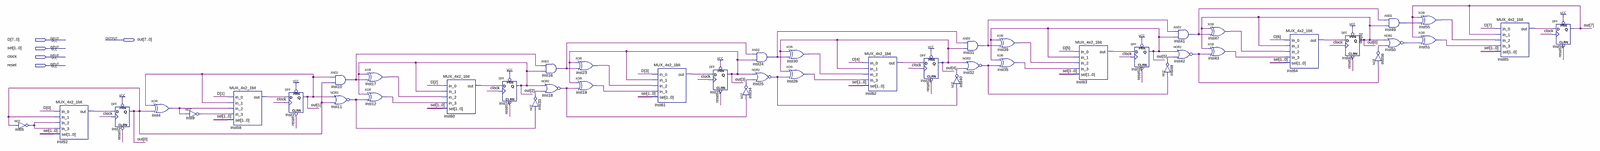
[diagram p0: schematic sheet, whole]
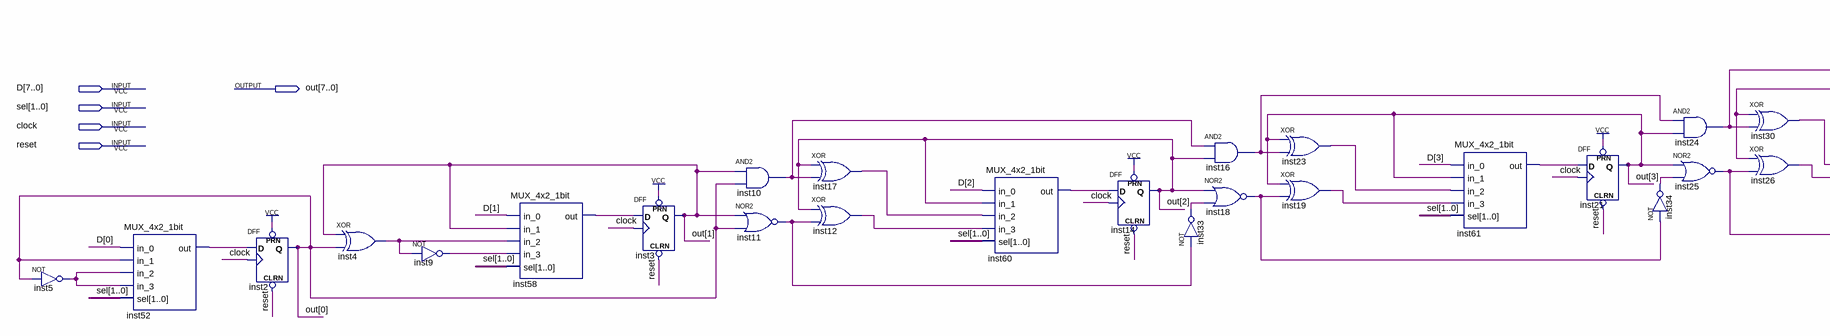
[diagram p1: schematic sheet, left part]
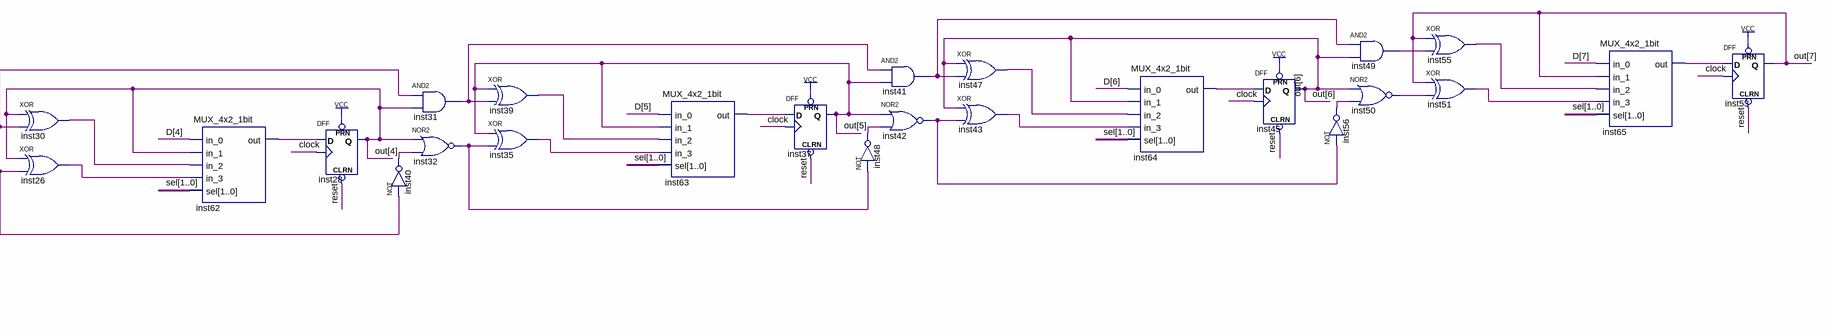
[diagram p2: schematic sheet, right part]
// Quartus schematic CounterUpDown.bdf as structural Verilog: 48 symbols, 5 pins
module CounterUpDown (
  input  [7:0] D,
  input  [1:0] sel,
  input  clock,
  input  reset,
  output [7:0] out
);

  wire inst4_out, inst5_out, inst9_out, inst10_out, inst11_out, inst12_out, inst16_out, inst17_out,
       inst18_out, inst19_out, inst23_out, inst24_out, inst25_out, inst26_out, inst30_out, inst31_out,
       inst32_out, inst33_out, inst34_out, inst35_out, inst39_out, inst40_out, inst41_out, inst42_out,
       inst43_out, inst47_out, inst48_out, inst49_out, inst50_out, inst51_out, inst52_out, inst55_out,
       inst56_out, inst58_out, inst60_out, inst61_out, inst62_out, inst63_out, inst64_out, inst65_out;

  not inst5 (inst5_out, out[0]);
  MUX_4x2_1bit inst52 (.in_0(D[0]), .in_1(out[0]), .in_2(inst5_out), .in_3(inst5_out), .sel(sel), .out(inst52_out));
  DFF inst2 (.CLRN(reset), .CLK(clock), .D(inst52_out), .PRN(1'b1), .Q(out[0]));
  xor inst4 (inst4_out, out[1], out[0]);
  not inst9 (inst9_out, inst4_out);
  MUX_4x2_1bit inst58 (.in_0(D[1]), .in_1(out[1]), .in_2(inst4_out), .in_3(inst9_out), .sel(sel), .out(inst58_out));
  DFF inst3 (.CLRN(reset), .CLK(clock), .D(inst58_out), .PRN(1'b1), .Q(out[1]));
  and inst10 (inst10_out, out[1], out[0]);
  nor inst11 (inst11_out, out[1], out[0]);
  xor inst17 (inst17_out, out[2], inst10_out);
  xor inst12 (inst12_out, out[2], inst11_out);
  MUX_4x2_1bit inst60 (.in_0(D[2]), .in_1(out[2]), .in_2(inst17_out), .in_3(inst12_out), .sel(sel), .out(inst60_out));
  DFF inst14 (.CLRN(reset), .CLK(clock), .D(inst60_out), .PRN(1'b1), .Q(out[2]));
  and inst16 (inst16_out, inst10_out, out[2]);
  nor inst18 (inst18_out, out[2], inst33_out);
  not inst33 (inst33_out, inst11_out);
  xor inst23 (inst23_out, out[3], inst16_out);
  xor inst19 (inst19_out, out[3], inst18_out);
  MUX_4x2_1bit inst61 (.in_0(D[3]), .in_1(out[3]), .in_2(inst23_out), .in_3(inst19_out), .sel(sel), .out(inst61_out));
  DFF inst21 (.CLRN(reset), .CLK(clock), .D(inst61_out), .PRN(1'b1), .Q(out[3]));
  and inst24 (inst24_out, inst16_out, out[3]);
  nor inst25 (inst25_out, out[3], inst34_out);
  not inst34 (inst34_out, inst18_out);
  xor inst30 (inst30_out, out[4], inst24_out);
  xor inst26 (inst26_out, out[4], inst25_out);
  MUX_4x2_1bit inst62 (.in_0(D[4]), .in_1(out[4]), .in_2(inst30_out), .in_3(inst26_out), .sel(sel), .out(inst62_out));
  DFF inst28 (.CLRN(reset), .CLK(clock), .D(inst62_out), .PRN(1'b1), .Q(out[4]));
  not inst40 (inst40_out, inst25_out);
  and inst31 (inst31_out, inst24_out, out[4]);
  nor inst32 (inst32_out, out[4], inst40_out);
  xor inst39 (inst39_out, out[5], inst31_out);
  xor inst35 (inst35_out, out[5], inst32_out);
  MUX_4x2_1bit inst63 (.in_0(D[5]), .in_1(out[5]), .in_2(inst39_out), .in_3(inst35_out), .sel(sel), .out(inst63_out));
  DFF inst37 (.CLRN(reset), .CLK(clock), .D(inst63_out), .PRN(1'b1), .Q(out[5]));
  not inst48 (inst48_out, inst32_out);
  and inst41 (inst41_out, inst31_out, out[5]);
  nor inst42 (inst42_out, out[5], inst48_out);
  xor inst47 (inst47_out, out[6], inst41_out);
  xor inst43 (inst43_out, out[6], inst42_out);
  MUX_4x2_1bit inst64 (.in_0(D[6]), .in_1(out[6]), .in_2(inst47_out), .in_3(inst43_out), .sel(sel), .out(inst64_out));
  DFF inst45 (.CLRN(reset), .CLK(clock), .D(inst64_out), .PRN(1'b1), .Q(out[6]));
  and inst49 (inst49_out, inst41_out, out[6]);
  nor inst50 (inst50_out, out[6], inst56_out);
  not inst56 (inst56_out, inst42_out);
  xor inst55 (inst55_out, out[7], inst49_out);
  xor inst51 (inst51_out, out[7], inst50_out);
  MUX_4x2_1bit inst65 (.in_0(D[7]), .in_1(out[7]), .in_2(inst55_out), .in_3(inst51_out), .sel(sel), .out(inst65_out));
  DFF inst53 (.CLRN(reset), .CLK(clock), .D(inst65_out), .PRN(1'b1), .Q(out[7]));
endmodule
